# Altium schematic sheet TEMP.SchDoc
size 420 x 297 mm; SheetNumber: 18; SheetTotal: 32
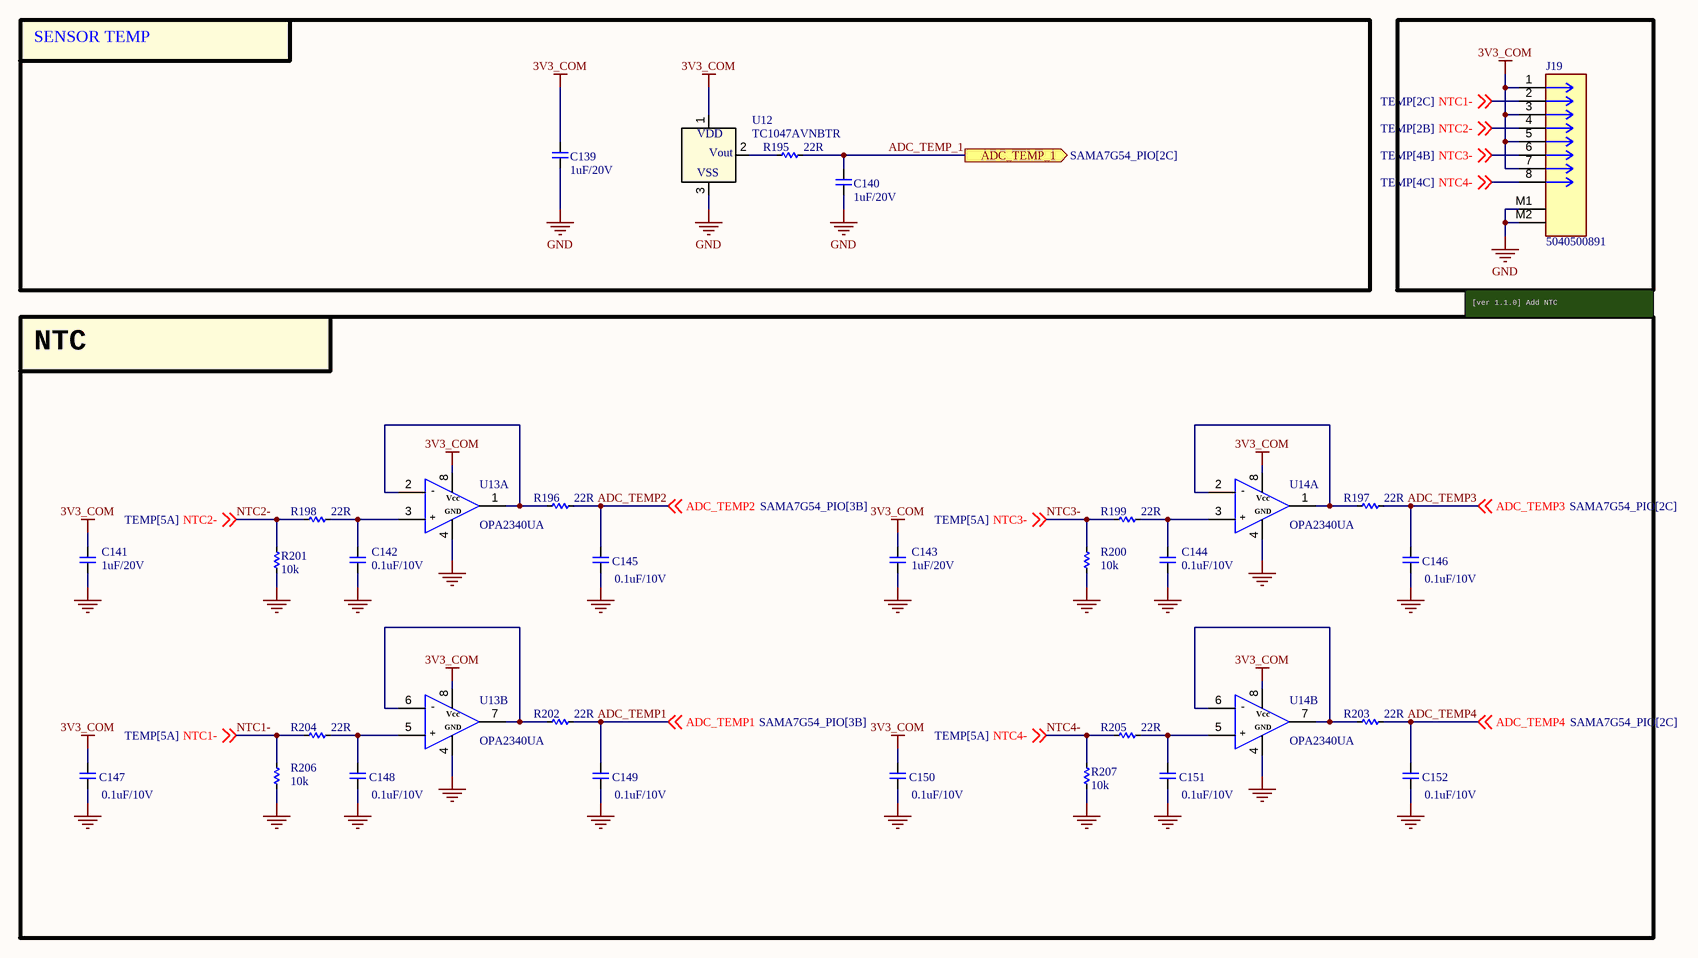
[diagram p0: TEMP.SchDoc]

## Parts
C139  1uF/20V  [CAP_C_1005X50_L]
C140  1uF/20V  [CAP_C_1005X50_L]
C141  1uF/20V  [CAP_C_1005X50_L]
C142  0.1uF/10V  [CAP_C_1005X50_L]
C143  1uF/20V  [CAP_C_1005X50_L]
C144  0.1uF/10V  [CAP_C_1005X50_L]
C145  0.1uF/10V  [CAP_C_1005X50_L]
C146  0.1uF/10V  [CAP_C_1005X50_L]
C147  0.1uF/10V  [CAP_C_1005X50_L]
C148  0.1uF/10V  [CAP_C_1005X50_L]
C149  0.1uF/10V  [CAP_C_1005X50_L]
C150  0.1uF/10V  [CAP_C_1005X50_L]
C151  0.1uF/10V  [CAP_C_1005X50_L]
C152  0.1uF/10V  [CAP_C_1005X50_L]
J19  5040500891  [MOLEX_5040500891]
R195  22R  [RES_C_1005x30_L]
R196  22R  [RES_C_1005x30_L]
R197  22R  [RES_C_1005x30_L]
R198  22R  [RES_C_1005x30_L]
R199  22R  [RES_C_1005x30_L]
R200  10k  [RES_C_1005x30_L]
R201  10k  [RES_C_1005x30_L]
R202  22R  [RES_C_1005x30_L]
R203  22R  [RES_C_1005x30_L]
R204  22R  [RES_C_1005x30_L]
R205  22R  [RES_C_1005x30_L]
R206  10k  [RES_C_1005x30_L]
R207  10k  [RES_C_1005x30_L]
U12  TC1047AVNBTR  [SOT-23_MC_MCH]
U13  OPA2340UA  [SOIC127P602X173-8N]  (parts A,B of 2)
U14  OPA2340UA  [SOIC127P602X173-8N]  (parts A,B of 2)

## Blocks framed on the sheet
SENSOR TEMP: C139 C140 R195 U12
NTC: C141-C152 R196-R207 U13 U14

## Ports
ADC_TEMP_1 (out, see SAMA7G54_PIO[2C])

## Nets
3V3_COM: C139.2 C141.2 C143.2 C147.2 C150.2 J19.1 J19.3 J19.5 J19.7 U12.1(VDD) U13.8 U14.8
GND: C139.1 C140.1 C141.1 C142.1 C143.1 C144.1 C145.1 C146.1 C147.1 C148.1 C149.1 C150.1 C151.1 C152.1 J19.M1 J19.M2 R200.1 R201.1 R206.1 R207.1 U12.3(VSS) U13.4 U14.4
ADC_TEMP1: C149.2 R202.2 ; off-sheet ADC_TEMP1
ADC_TEMP2: C145.2 R196.2 ; off-sheet ADC_TEMP2
ADC_TEMP3: C146.2 R197.2 ; off-sheet ADC_TEMP3
ADC_TEMP4: C152.2 R203.2 ; off-sheet ADC_TEMP4
ADC_TEMP_1: C140.2 R195.2 ; port ADC_TEMP_1
NTC1-: J19.2 R204.1 R206.2 ; off-sheet NTC1-
NTC2-: J19.4 R198.1 R201.2 ; off-sheet NTC2-
NTC3-: J19.6 R199.1 R200.2 ; off-sheet NTC3-
NTC4-: J19.8 R205.1 R207.2 ; off-sheet NTC4-
NetC142_2: C142.2 R198.2 U13.3
NetC144_2: C144.2 R199.2 U14.3
NetC148_2: C148.2 R204.2 U13.5
NetC151_2: C151.2 R205.2 U14.5
NetR195_1: R195.1 U12.2(VOUT)
NetR196_1: R196.1 U13.1 U13.2
NetR197_1: R197.1 U14.1 U14.2
NetR202_1: R202.1 U13.6 U13.7
NetR203_1: R203.1 U14.6 U14.7

## Notes on the sheet
- [ver 1.1.0] Add NTC
- Project:
- Sub-system:
- Design by:
- Sheet title:
- Sheet
- A3
- of
- Checked by:
- Approved by:
- Revision:
- Document No:
- Size:
- Date:
- (in symbol OPA2340UA, part A) -; Vcc; GND; +
- (in symbol OPA2340UA, part B) -; Vcc; GND; +
- (in symbol TC1047AVNBTR) Vout

## Library data of the parts
C139-C141 C143 = _CAP_C_2: CAP CHIP
C142 C144-C152 = _CAP_C_2: CAP
J19 = 5040500891: Connector Header Surface Mount, Right Angle 8 position 0.059" (1.50mm)`
R195-R207 = _RES_B_2: RES
U12 = TC1047AVNBTR: SENSOR ANALOG -40C-125C SOT23-3; Manufacturer_Name: Microchip; Copyright: Copyright (C) 2025 Ultra Librarian. All rights reserved.; Manufacturer_Part_Number: TC1047AVNBTR; RefDes: RefDes; Type: Type